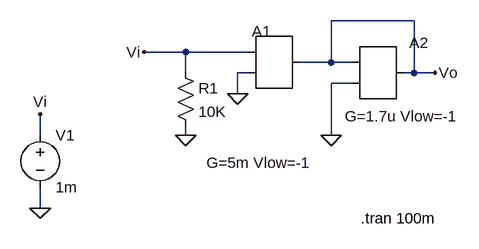
[diagram p0: schematic ej1c.asc]
ej1c.asc, the LTspice schematic file:
Version 4
SHEET 1 880 680
WIRE 336 96 208 96
WIRE -16 144 -80 144
WIRE 80 144 -16 144
WIRE 208 160 208 96
WIRE 208 160 160 160
WIRE 240 160 208 160
WIRE -16 176 -16 144
WIRE 80 176 64 176
WIRE 336 176 336 96
WIRE 336 176 320 176
WIRE 368 176 336 176
WIRE 240 192 208 192
WIRE 64 208 64 176
WIRE -240 272 -240 240
WIRE -16 272 -16 256
WIRE 208 272 208 192
WIRE -240 384 -240 352
FLAG -16 272 0
FLAG 64 208 0
FLAG 208 272 0
FLAG -240 384 0
FLAG -240 240 Vi
FLAG -80 144 Vi
FLAG 368 176 Vo
SYMBOL SpecialFunctions\\ota 112 96 R0
WINDOW 0 -26 16 Left 2
WINDOW 3 -96 218 Left 2
SYMATTR InstName A1
SYMATTR Value G=5m Vlow=-1
SYMBOL SpecialFunctions\\ota 272 112 R0
WINDOW 3 -43 131 Left 2
SYMATTR InstName A2
SYMATTR Value G=1.7u Vlow=-1
SYMBOL res -32 160 R0
SYMATTR InstName R1
SYMATTR Value 10K
SYMBOL voltage -240 256 R0
WINDOW 123 0 0 Left 0
WINDOW 39 0 0 Left 0
SYMATTR InstName V1
SYMATTR Value 1m
TEXT 254 400 Left 2 !.tran 100m

The netlist it stands for:
* ej1c.asc
A1 Vi 0 0 0 0 0 Vo 0 OTA G=5m Vlow=-1
A2 Vo 0 0 0 0 0 Vo 0 OTA G=1.7u Vlow=-1
R1 Vi 0 10K
V1 Vi 0 1m
.tran 100m
.backanno
.end